# EAGLE schematic PushButton_RGB_w_Test (EAGLE 9.6.2)
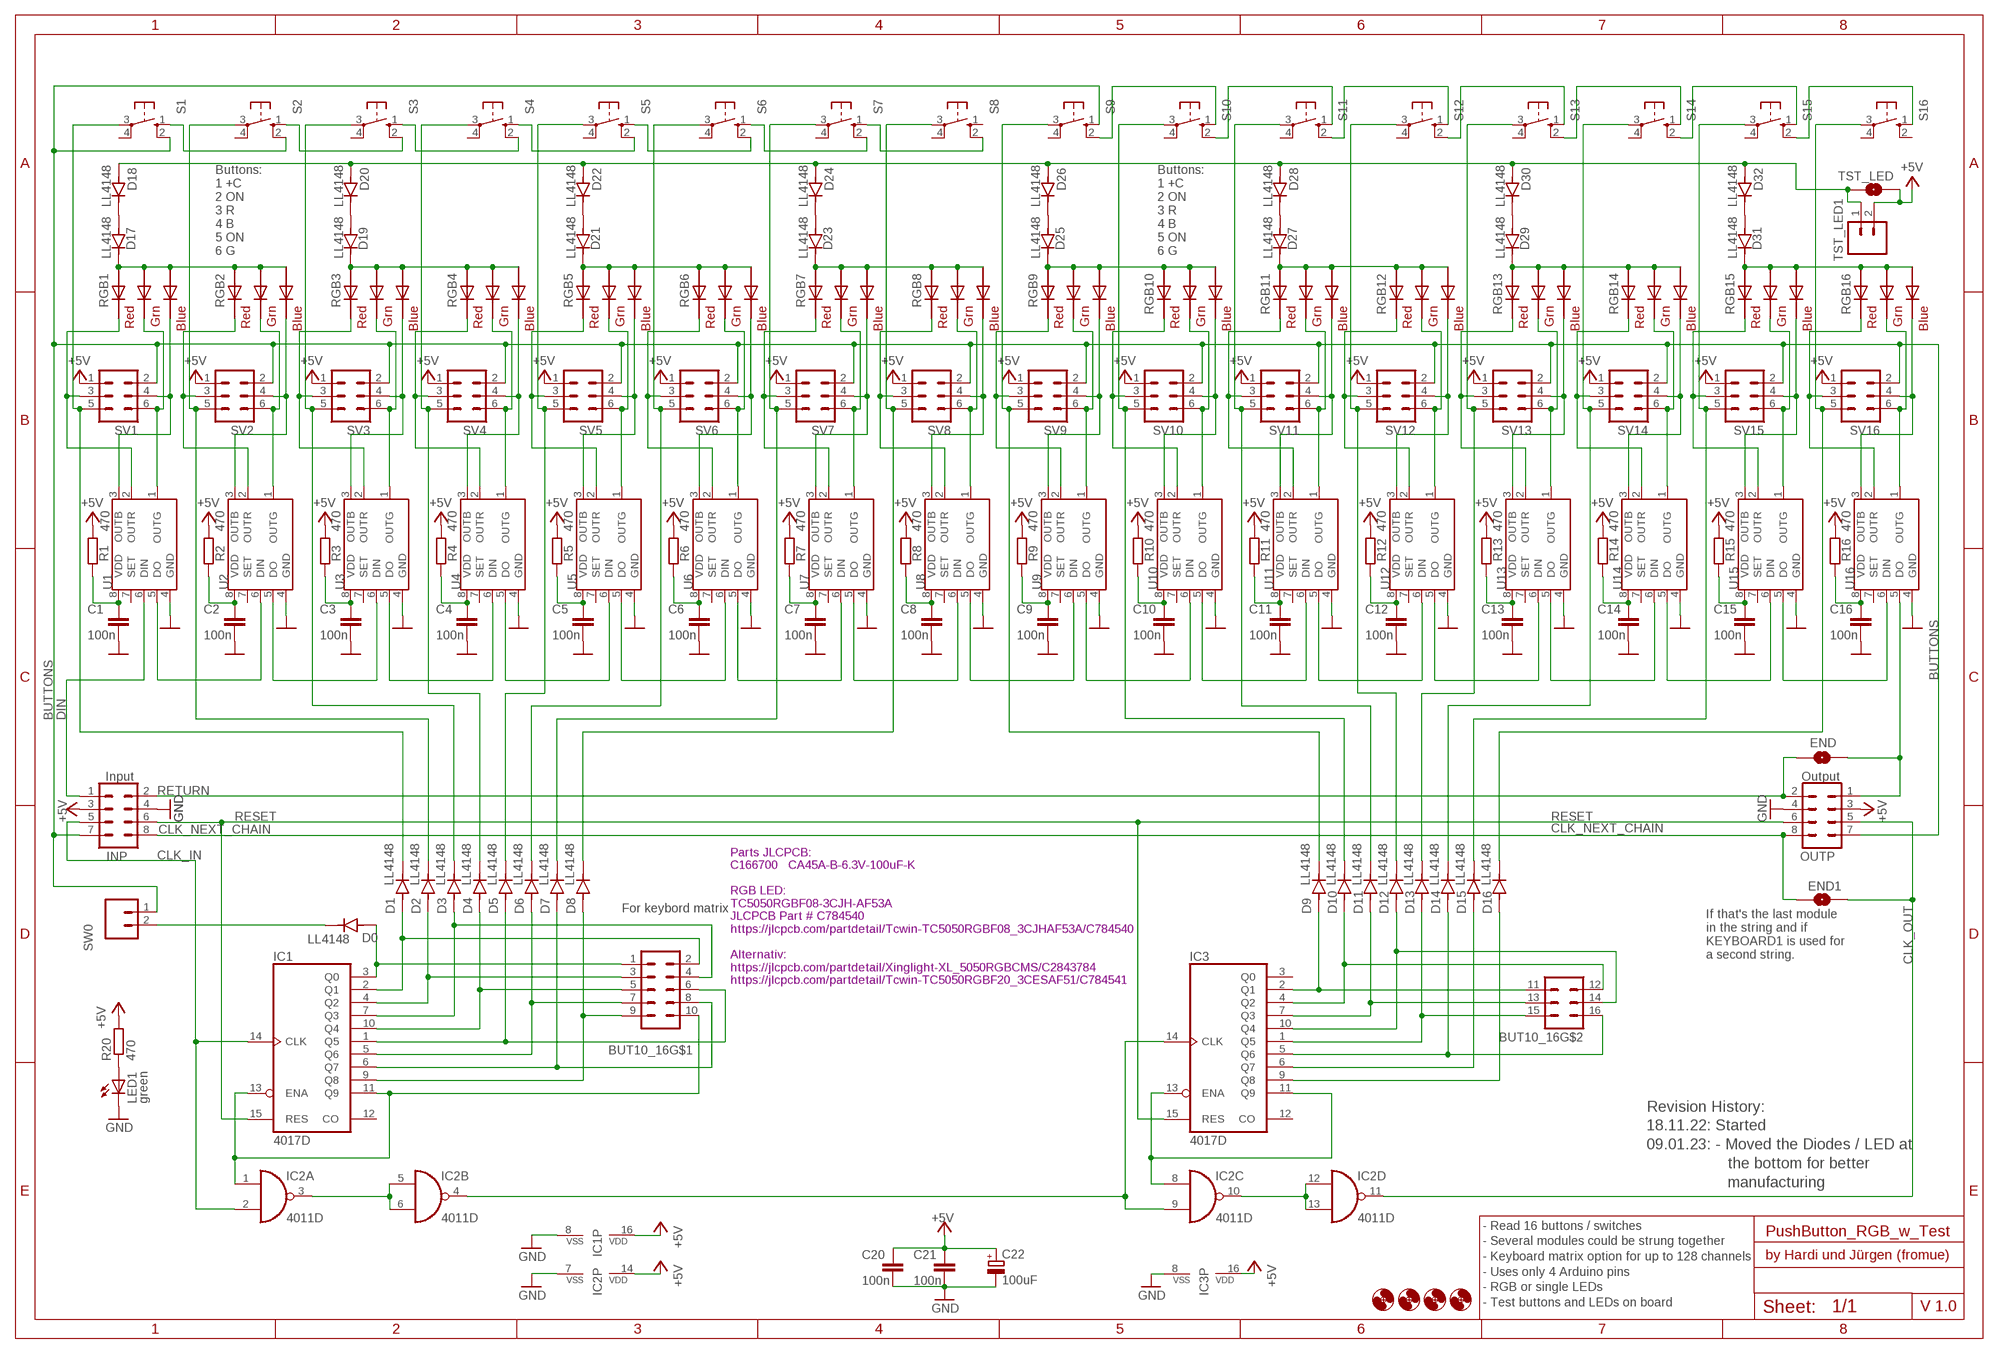
[diagram p0: schematic, sheet 1]

## Parts
BUT10_16  CON-HARTING-ML_ML16-2  [CON-HARTING-ML_ML16]
C1  100n  C-EUC0603  [C0603]
C2  100n  C-EUC0603  [C0603]
C3  100n  C-EUC0603  [C0603]
C4  100n  C-EUC0603  [C0603]
C5  100n  C-EUC0603  [C0603]
C6  100n  C-EUC0603  [C0603]
C7  100n  C-EUC0603  [C0603]
C8  100n  C-EUC0603  [C0603]
C9  100n  C-EUC0603  [C0603]
C10  100n  C-EUC0603  [C0603]
C11  100n  C-EUC0603  [C0603]
C12  100n  C-EUC0603  [C0603]
C13  100n  C-EUC0603  [C0603]
C14  100n  C-EUC0603  [C0603]
C15  100n  C-EUC0603  [C0603]
C16  100n  C-EUC0603  [C0603]
C20  100n  C-EUC0603  [C0603]
C21  100n  C-EUC0603  [C0603]
C22  100uF  CPOL-EUB/3528-21R  [B/3528-21R]
D0  LL4148  [DIO_LL4148]
D1  LL4148  [DIO_LL4148]
D2  LL4148  [DIO_LL4148]
D3  LL4148  [DIO_LL4148]
D4  LL4148  [DIO_LL4148]
D5  LL4148  [DIO_LL4148]
D6  LL4148  [DIO_LL4148]
D7  LL4148  [DIO_LL4148]
D8  LL4148  [DIO_LL4148]
D9  LL4148  [DIO_LL4148]
D10  LL4148  [DIO_LL4148]
D11  LL4148  [DIO_LL4148]
D12  LL4148  [DIO_LL4148]
D13  LL4148  [DIO_LL4148]
D14  LL4148  [DIO_LL4148]
D15  LL4148  [DIO_LL4148]
D16  LL4148  [DIO_LL4148]
D17  LL4148  [DIO_LL4148]
D18  LL4148  [DIO_LL4148]
D19  LL4148  [DIO_LL4148]
D20  LL4148  [DIO_LL4148]
D21  LL4148  [DIO_LL4148]
D22  LL4148  [DIO_LL4148]
D23  LL4148  [DIO_LL4148]
D24  LL4148  [DIO_LL4148]
D25  LL4148  [DIO_LL4148]
D26  LL4148  [DIO_LL4148]
D27  LL4148  [DIO_LL4148]
D28  LL4148  [DIO_LL4148]
D29  LL4148  [DIO_LL4148]
D30  LL4148  [DIO_LL4148]
D31  LL4148  [DIO_LL4148]
D32  LL4148  [DIO_LL4148]
END  SOLDERJUMPERNO  [SJ_2S-NO]
END1  SOLDERJUMPERNO  [SJ_2S-NO]
H1  MOUNT-HOLE3.0  [3,0]
H2  MOUNT-HOLE3.0  [3,0]
H3  MOUNT-HOLE3.0  [3,0]
H4  MOUNT-HOLE3.0  [3,0]
IC1  4017D  [SO16]
IC2  4011D  [SO14]
IC3  4017D  [SO16]
INP  CON-HARTING-ML_ML08  [CON-HARTING-ML_ML08]
LED1  green  LEDCHIPLED_0805  [CHIPLED_0805]
OUTP  CON-HARTING-ML_ML08  [CON-HARTING-ML_ML08]
R1  470  R-EU_R0603  [R0603]
R2  470  R-EU_R0603  [R0603]
R3  470  R-EU_R0603  [R0603]
R4  470  R-EU_R0603  [R0603]
R5  470  R-EU_R0603  [R0603]
R6  470  R-EU_R0603  [R0603]
R7  470  R-EU_R0603  [R0603]
R8  470  R-EU_R0603  [R0603]
R9  470  R-EU_R0603  [R0603]
R10  470  R-EU_R0603  [R0603]
R11  470  R-EU_R0603  [R0603]
R12  470  R-EU_R0603  [R0603]
R13  470  R-EU_R0603  [R0603]
R14  470  R-EU_R0603  [R0603]
R15  470  R-EU_R0603  [R0603]
R16  470  R-EU_R0603  [R0603]
R20  470  R-EU_R0603  [R0603]
RGB1  RGBLED5050  [RGBLED5050]
RGB2  RGBLED5050  [RGBLED5050]
RGB3  RGBLED5050  [RGBLED5050]
RGB4  RGBLED5050  [RGBLED5050]
RGB5  RGBLED5050  [RGBLED5050]
RGB6  RGBLED5050  [RGBLED5050]
RGB7  RGBLED5050  [RGBLED5050]
RGB8  RGBLED5050  [RGBLED5050]
RGB9  RGBLED5050  [RGBLED5050]
RGB10  RGBLED5050  [RGBLED5050]
RGB11  RGBLED5050  [RGBLED5050]
RGB12  RGBLED5050  [RGBLED5050]
RGB13  RGBLED5050  [RGBLED5050]
RGB14  RGBLED5050  [RGBLED5050]
RGB15  RGBLED5050  [RGBLED5050]
RGB16  RGBLED5050  [RGBLED5050]
S1  10-XXB3F-10XX_SMD  [B3F-10XX_SMD]
S2  10-XXB3F-10XX_SMD  [B3F-10XX_SMD]
S3  10-XXB3F-10XX_SMD  [B3F-10XX_SMD]
S4  10-XXB3F-10XX_SMD  [B3F-10XX_SMD]
S5  10-XXB3F-10XX_SMD  [B3F-10XX_SMD]
S6  10-XXB3F-10XX_SMD  [B3F-10XX_SMD]
S7  10-XXB3F-10XX_SMD  [B3F-10XX_SMD]
S8  10-XXB3F-10XX_SMD  [B3F-10XX_SMD]
S9  10-XXB3F-10XX_SMD  [B3F-10XX_SMD]
S10  10-XXB3F-10XX_SMD  [B3F-10XX_SMD]
S11  10-XXB3F-10XX_SMD  [B3F-10XX_SMD]
S12  10-XXB3F-10XX_SMD  [B3F-10XX_SMD]
S13  10-XXB3F-10XX_SMD  [B3F-10XX_SMD]
S14  10-XXB3F-10XX_SMD  [B3F-10XX_SMD]
S15  10-XXB3F-10XX_SMD  [B3F-10XX_SMD]
S16  10-XXB3F-10XX_SMD  [B3F-10XX_SMD]
SV1  CON-HARTING-ML_ML6  [CON-HARTING-ML_ML6]
SV2  CON-HARTING-ML_ML6  [CON-HARTING-ML_ML6]
SV3  CON-HARTING-ML_ML6  [CON-HARTING-ML_ML6]
SV4  CON-HARTING-ML_ML6  [CON-HARTING-ML_ML6]
SV5  CON-HARTING-ML_ML6  [CON-HARTING-ML_ML6]
SV6  CON-HARTING-ML_ML6  [CON-HARTING-ML_ML6]
SV7  CON-HARTING-ML_ML6  [CON-HARTING-ML_ML6]
SV8  CON-HARTING-ML_ML6  [CON-HARTING-ML_ML6]
SV9  CON-HARTING-ML_ML6  [CON-HARTING-ML_ML6]
SV10  CON-HARTING-ML_ML6  [CON-HARTING-ML_ML6]
SV11  CON-HARTING-ML_ML6  [CON-HARTING-ML_ML6]
SV12  CON-HARTING-ML_ML6  [CON-HARTING-ML_ML6]
SV13  CON-HARTING-ML_ML6  [CON-HARTING-ML_ML6]
SV14  CON-HARTING-ML_ML6  [CON-HARTING-ML_ML6]
SV15  CON-HARTING-ML_ML6  [CON-HARTING-ML_ML6]
SV16  CON-HARTING-ML_ML6  [CON-HARTING-ML_ML6]
SW0  M02PTH  [1X02]
TST_LED  SOLDERJUMPERNO  [SJ_2S-NO]
TST_LED1  Tst_LED  M02PTH  [1X02]
U1  S3PO_MODUL_WS2811_SOUND_MP3-TF-16P_WS2811_AND_ATTINY_WS2811-ICSOP8  [SOP8]
U2  S3PO_MODUL_WS2811_SOUND_MP3-TF-16P_WS2811_AND_ATTINY_WS2811-ICSOP8  [SOP8]
U3  S3PO_MODUL_WS2811_SOUND_MP3-TF-16P_WS2811_AND_ATTINY_WS2811-ICSOP8  [SOP8]
U4  S3PO_MODUL_WS2811_SOUND_MP3-TF-16P_WS2811_AND_ATTINY_WS2811-ICSOP8  [SOP8]
U5  S3PO_MODUL_WS2811_SOUND_MP3-TF-16P_WS2811_AND_ATTINY_WS2811-ICSOP8  [SOP8]
U6  S3PO_MODUL_WS2811_SOUND_MP3-TF-16P_WS2811_AND_ATTINY_WS2811-ICSOP8  [SOP8]
U7  S3PO_MODUL_WS2811_SOUND_MP3-TF-16P_WS2811_AND_ATTINY_WS2811-ICSOP8  [SOP8]
U8  S3PO_MODUL_WS2811_SOUND_MP3-TF-16P_WS2811_AND_ATTINY_WS2811-ICSOP8  [SOP8]
U9  S3PO_MODUL_WS2811_SOUND_MP3-TF-16P_WS2811_AND_ATTINY_WS2811-ICSOP8  [SOP8]
U10  S3PO_MODUL_WS2811_SOUND_MP3-TF-16P_WS2811_AND_ATTINY_WS2811-ICSOP8  [SOP8]
U11  S3PO_MODUL_WS2811_SOUND_MP3-TF-16P_WS2811_AND_ATTINY_WS2811-ICSOP8  [SOP8]
U12  S3PO_MODUL_WS2811_SOUND_MP3-TF-16P_WS2811_AND_ATTINY_WS2811-ICSOP8  [SOP8]
U13  S3PO_MODUL_WS2811_SOUND_MP3-TF-16P_WS2811_AND_ATTINY_WS2811-ICSOP8  [SOP8]
U14  S3PO_MODUL_WS2811_SOUND_MP3-TF-16P_WS2811_AND_ATTINY_WS2811-ICSOP8  [SOP8]
U15  S3PO_MODUL_WS2811_SOUND_MP3-TF-16P_WS2811_AND_ATTINY_WS2811-ICSOP8  [SOP8]
U16  S3PO_MODUL_WS2811_SOUND_MP3-TF-16P_WS2811_AND_ATTINY_WS2811-ICSOP8  [SOP8]

## Nets
+5V: C20.1 C21.1 C22.+ IC1.16(VDD) IC2.14(P:VDD) IC3.16(VDD) INP.3 OUTP.3 R1.2 R2.2 R3.2 R4.2 R5.2 R6.2 R7.2 R8.2 R9.2 R10.2 R11.2 R12.2 R13.2 R14.2 R15.2 R16.2 R20.2 SV1.1 SV2.1 SV3.1 SV4.1 SV5.1 SV6.1 SV7.1 SV8.1 SV9.1 SV10.1 SV11.1 SV12.1 SV13.1 SV14.1 SV15.1 SV16.1 TST_LED1.2 TST_LED.1
BUTTONS: INP.7 OUTP.7 S1.2(S1) S9.1(S) SV1.2 SV2.2 SV3.2 SV4.2 SV5.2 SV6.2 SV7.2 SV8.2 SV9.2 SV10.2 SV11.2 SV12.2 SV13.2 SV14.2 SV15.2 SV16.2 SW0.1
CLK_IN: IC1.14(CLK) IC2.2(A:I1) INP.5
CLK_NEXT_CHAIN: END1.2 INP.8 OUTP.8
CLK_OUT: END1.1 IC2.11(D:O) OUTP.5
DIN: INP.1 U1.6(DIN)
GND: C1.2 C2.2 C3.2 C4.2 C5.2 C6.2 C7.2 C8.2 C9.2 C10.2 C11.2 C12.2 C13.2 C14.2 C15.2 C16.2 C20.2 C21.2 C22.- IC1.8(VSS) IC2.7(P:VSS) IC3.8(VSS) INP.4 LED1.C OUTP.4 U1.4(GND) U2.4(GND) U3.4(GND) U4.4(GND) U5.4(GND) U6.4(GND) U7.4(GND) U8.4(GND) U9.4(GND) U10.4(GND) U11.4(GND) U12.4(GND) U13.4(GND) U14.4(GND) U15.4(GND) U16.4(GND)
N$1: IC2.3(A:O) IC2.5(B:I0) IC2.6(B:I1)
N$2: U10.5(DO) U11.6(DIN)
N$3: BUT10_16.11 D9.A IC3.2(Q1)
N$4: U1.5(DO) U2.6(DIN)
N$5: BUT10_16.10 IC1.11(Q9) IC1.13(ENA) IC2.1(A:I0)
N$6: C2.1 R2.1 U2.8(VDD)
N$7: D0.C SW0.2
N$8: RGB2.4(BLUE_C) SV2.4 U2.3(OUTB)
N$9: RGB2.6(GREEN_C) SV2.6 U2.1(OUTG)
N$10: RGB2.5(RED_C) SV2.3 U2.2(OUTR)
N$11: BUT10_16.2 D1.A IC1.2(Q1)
N$12: BUT10_16.3 D2.A IC1.4(Q2)
N$13: BUT10_16.4 D3.A IC1.7(Q3)
N$14: BUT10_16.5 D4.A IC1.10(Q4)
N$15: BUT10_16.6 D5.A IC1.1(Q5)
N$16: BUT10_16.7 D6.A IC1.5(Q6)
N$17: BUT10_16.8 D7.A IC1.6(Q7)
N$18: BUT10_16.9 D8.A IC1.9(Q8)
N$19: RGB1.5(RED_C) SV1.3 U1.2(OUTR)
N$20: D18.A D20.A D22.A D24.A D26.A D28.A D30.A D32.A TST_LED1.1 TST_LED.2
N$21: LED1.A R20.1
N$22: D17.A D18.C
N$23: S1.1(S) S2.2(S1)
N$24: U2.5(DO) U3.6(DIN)
N$25: D10.C S10.3(P) SV10.5
N$26: RGB1.4(BLUE_C) SV1.4 U1.3(OUTB)
N$27: RGB1.6(GREEN_C) SV1.6 U1.1(OUTG)
N$28: BUT10_16.12 D10.A IC3.4(Q2)
N$29: BUT10_16.13 D11.A IC3.7(Q3)
N$30: BUT10_16.14 D12.A IC3.10(Q4)
N$31: BUT10_16.15 D13.A IC3.1(Q5)
N$32: S2.1(S) S3.2(S1)
N$33: BUT10_16.16 D14.A IC3.5(Q6)
N$34: S3.1(S) S4.2(S1)
N$35: BUT10_16.1 D0.A IC1.3(Q0)
N$36: D15.A IC3.6(Q7)
N$37: D16.A IC3.9(Q8)
N$38: IC2.10(C:O) IC2.12(D:I0) IC2.13(D:I1)
N$39: D19.A D20.C
N$40: IC2.8(C:I0) IC3.11(Q9) IC3.13(ENA)
N$41: IC2.4(B:O) IC2.9(C:I1) IC3.14(CLK)
N$42: S4.1(S) S5.2(S1)
N$43: D21.A D22.C
N$44: S5.1(S) S6.2(S1)
N$45: C3.1 R3.1 U3.8(VDD)
N$46: D3.C S3.3(P) SV3.5
N$47: RGB3.4(BLUE_C) SV3.4 U3.3(OUTB)
N$48: RGB3.6(GREEN_C) SV3.6 U3.1(OUTG)
N$49: RGB3.5(RED_C) SV3.3 U3.2(OUTR)
N$50: D19.C RGB3.1(GREEN_A) RGB3.2(RED_A) RGB3.3(BLUE_A) RGB4.1(GREEN_A) RGB4.2(RED_A) RGB4.3(BLUE_A)
N$51: S6.1(S) S7.2(S1)
N$52: U3.5(DO) U4.6(DIN)
N$53: D23.A D24.C
N$54: S7.1(S) S8.2(S1)
N$55: D25.A D26.C
N$56: C4.1 R4.1 U4.8(VDD)
N$57: S9.2(S1) S10.1(S)
N$58: RGB4.4(BLUE_C) SV4.4 U4.3(OUTB)
N$59: RGB4.6(GREEN_C) SV4.6 U4.1(OUTG)
N$60: RGB4.5(RED_C) SV4.3 U4.2(OUTR)
N$61: S10.2(S1) S11.1(S)
N$62: S11.2(S1) S12.1(S)
N$63: U4.5(DO) U5.6(DIN)
N$64: D27.A D28.C
N$65: S12.2(S1) S13.1(S)
N$66: D29.A D30.C
N$67: C5.1 R5.1 U5.8(VDD)
N$68: S13.2(S1) S14.1(S)
N$69: RGB5.4(BLUE_C) SV5.4 U5.3(OUTB)
N$70: RGB5.6(GREEN_C) SV5.6 U5.1(OUTG)
N$71: RGB5.5(RED_C) SV5.3 U5.2(OUTR)
N$72: D21.C RGB5.1(GREEN_A) RGB5.2(RED_A) RGB5.3(BLUE_A) RGB6.1(GREEN_A) RGB6.2(RED_A) RGB6.3(BLUE_A)
N$73: S14.2(S1) S15.1(S)
N$74: D31.A D32.C
N$75: U5.5(DO) U6.6(DIN)
N$76: C1.1 R1.1 U1.8(VDD)
N$77: S15.2(S1) S16.1(S)
N$80: C6.1 R6.1 U6.8(VDD)
N$82: RGB6.4(BLUE_C) SV6.4 U6.3(OUTB)
N$83: RGB6.6(GREEN_C) SV6.6 U6.1(OUTG)
N$84: RGB6.5(RED_C) SV6.3 U6.2(OUTR)
N$87: U6.5(DO) U7.6(DIN)
N$91: C7.1 R7.1 U7.8(VDD)
N$93: C10.1 R10.1 U10.8(VDD)
N$96: RGB7.4(BLUE_C) SV7.4 U7.3(OUTB)
N$97: RGB7.6(GREEN_C) SV7.6 U7.1(OUTG)
N$98: RGB7.5(RED_C) SV7.3 U7.2(OUTR)
N$99: D23.C RGB7.1(GREEN_A) RGB7.2(RED_A) RGB7.3(BLUE_A) RGB8.1(GREEN_A) RGB8.2(RED_A) RGB8.3(BLUE_A)
N$101: U7.5(DO) U8.6(DIN)
N$105: C8.1 R8.1 U8.8(VDD)
N$107: RGB8.4(BLUE_C) SV8.4 U8.3(OUTB)
N$108: RGB8.6(GREEN_C) SV8.6 U8.1(OUTG)
N$109: RGB8.5(RED_C) SV8.3 U8.2(OUTR)
N$112: U8.5(DO) U9.6(DIN)
N$116: RGB10.4(BLUE_C) SV10.4 U10.3(OUTB)
N$117: RGB10.6(GREEN_C) SV10.6 U10.1(OUTG)
N$118: RGB10.5(RED_C) SV10.3 U10.2(OUTR)
N$119: C12.1 R12.1 U12.8(VDD)
N$120: D1.C S1.3(P) SV1.5
N$121: D2.C S2.3(P) SV2.5
N$123: D4.C S4.3(P) SV4.5
N$124: D5.C S5.3(P) SV5.5
N$125: D6.C S6.3(P) SV6.5
N$126: D7.C S7.3(P) SV7.5
N$127: D8.C S8.3(P) SV8.5
N$128: C9.1 R9.1 U9.8(VDD)
N$129: D17.C RGB1.1(GREEN_A) RGB1.2(RED_A) RGB1.3(BLUE_A) RGB2.1(GREEN_A) RGB2.2(RED_A) RGB2.3(BLUE_A)
N$130: D12.C S12.3(P) SV12.5
N$132: D9.C S9.3(P) SV9.5
N$134: RGB12.4(BLUE_C) SV12.4 U12.3(OUTB)
N$136: RGB9.4(BLUE_C) SV9.4 U9.3(OUTB)
N$137: RGB9.6(GREEN_C) SV9.6 U9.1(OUTG)
N$138: RGB9.5(RED_C) SV9.3 U9.2(OUTR)
N$139: D25.C RGB9.1(GREEN_A) RGB9.2(RED_A) RGB9.3(BLUE_A) RGB10.1(GREEN_A) RGB10.2(RED_A) RGB10.3(BLUE_A)
N$141: U9.5(DO) U10.6(DIN)
N$145: C11.1 R11.1 U11.8(VDD)
N$146: D11.C S11.3(P) SV11.5
N$147: RGB11.4(BLUE_C) SV11.4 U11.3(OUTB)
N$148: RGB11.6(GREEN_C) SV11.6 U11.1(OUTG)
N$149: RGB11.5(RED_C) SV11.3 U11.2(OUTR)
N$152: U11.5(DO) U12.6(DIN)
N$155: RGB12.6(GREEN_C) SV12.6 U12.1(OUTG)
N$156: RGB12.5(RED_C) SV12.3 U12.2(OUTR)
N$157: D27.C RGB11.1(GREEN_A) RGB11.2(RED_A) RGB11.3(BLUE_A) RGB12.1(GREEN_A) RGB12.2(RED_A) RGB12.3(BLUE_A)
N$159: U12.5(DO) U13.6(DIN)
N$163: C13.1 R13.1 U13.8(VDD)
N$164: D13.C S13.3(P) SV13.5
N$165: RGB13.4(BLUE_C) SV13.4 U13.3(OUTB)
N$166: RGB13.6(GREEN_C) SV13.6 U13.1(OUTG)
N$167: RGB13.5(RED_C) SV13.3 U13.2(OUTR)
N$168: D29.C RGB13.1(GREEN_A) RGB13.2(RED_A) RGB13.3(BLUE_A) RGB14.1(GREEN_A) RGB14.2(RED_A) RGB14.3(BLUE_A)
N$170: U13.5(DO) U14.6(DIN)
N$174: C14.1 R14.1 U14.8(VDD)
N$175: D14.C S14.3(P) SV14.5
N$176: RGB14.4(BLUE_C) SV14.4 U14.3(OUTB)
N$177: RGB14.6(GREEN_C) SV14.6 U14.1(OUTG)
N$178: RGB14.5(RED_C) SV14.3 U14.2(OUTR)
N$181: U14.5(DO) U15.6(DIN)
N$185: C15.1 R15.1 U15.8(VDD)
N$186: D15.C S15.3(P) SV15.5
N$187: RGB15.4(BLUE_C) SV15.4 U15.3(OUTB)
N$188: RGB15.6(GREEN_C) SV15.6 U15.1(OUTG)
N$189: RGB15.5(RED_C) SV15.3 U15.2(OUTR)
N$190: D31.C RGB15.1(GREEN_A) RGB15.2(RED_A) RGB15.3(BLUE_A) RGB16.1(GREEN_A) RGB16.2(RED_A) RGB16.3(BLUE_A)
N$192: U15.5(DO) U16.6(DIN)
N$196: C16.1 R16.1 U16.8(VDD)
N$197: D16.C S16.3(P) SV16.5
N$198: RGB16.4(BLUE_C) SV16.4 U16.3(OUTB)
N$199: RGB16.6(GREEN_C) SV16.6 U16.1(OUTG)
N$200: RGB16.5(RED_C) SV16.3 U16.2(OUTR)
N$203: END.2 OUTP.1 U16.5(DO)
RESET: IC1.15(RES) IC3.15(RES) INP.6 OUTP.6
RETURN: END.1 INP.2 OUTP.2
Unconnected: IC1.12(CO) IC3.3(Q0) IC3.12(CO) S1.4(P1) S2.4(P1) S3.4(P1) S4.4(P1) S5.4(P1) S6.4(P1) S7.4(P1) S8.1(S) S8.4(P1) S9.4(P1) S10.4(P1) S11.4(P1) S12.4(P1) S13.4(P1) S14.4(P1) S15.4(P1) S16.2(S1) S16.4(P1) U1.7(SET) U2.7(SET) U3.7(SET) U4.7(SET) U5.7(SET) U6.7(SET) U7.7(SET) U8.7(SET) U9.7(SET) U10.7(SET) U11.7(SET) U12.7(SET) U13.7(SET) U14.7(SET) U15.7(SET) U16.7(SET)

## Notes on the sheet
- Buttons:
  1 +C
  2 ON
  3 R
  4 B
  5 ON
  6 G
- Buttons:
  1 +C
  2 ON
  3 R
  4 B
  5 ON
  6 G
- Input | Output
- Parts JLCPCB:
  C166700   CA45A-B-6.3V-100uF-K
  
  RGB LED:
  TC5050RGBF08-3CJH-AF53A
  JLCPCB Part # C784540
  https://jlcpcb.com/partdetail/Tcwin-TC5050RGBF08_3CJHAF53A/C784540
  
  Alternativ:
  https://jlcpcb.com/partdetail/Xinglight-XL_5050RGBCMS/C2843784
  https://jlcpcb.com/partdetail/Tcwin-TC5050RGBF20_3CESAF51/C784541
- For keybord matrix
- If that's the last module
  in the string and if
  KEYBOARD1 is used for
  a second string.
- Revision History:
  18.11.22: Started
  09.01.23: - Moved the Diodes / LED at
                    the bottom for better
                    manufacturing
- - Read 16 buttons / switches
  - Several modules could be strung together
  - Keyboard matrix option for up to 128 channels
  - Uses only 4 Arduino pins
  - RGB or single LEDs
  - Test buttons and LEDs on board
- by Hardi und Jürgen (fromue)
- V 1.0

## Library data of the parts
BUT10_16 = PushButtonAction_4017_2:CON-HARTING-ML_ML16-2: HARTING
C1-C16 C20 C21 = rcl:C-EU: CAPACITOR, European symbol; SPICEPREFIX: C
C22 = rcl:CPOL-EU: POLARIZED CAPACITOR, European symbol; SPICEPREFIX: C
D0 D1-D32 = LL4148:LL4148: Surface Mount Switching Glass Check availability <https://pricing.snapeda.com/parts/LL4148/ON/view-part?ref=eda>; AVAILABILITY: In Stock; DESCRIPTION: Diode Standard 75V 300mA (DC) Surface Mount Mini MELF/DL-35; MF: ON; MP: LL4148; PACKAGE: SOD-80 Fairchild Semiconductor; PRICE: None
END END1 TST_LED = SparkFun-Retired:SOLDERJUMPER: Solder Jumper Standard SMD solder jumper. Used to automate production. Two varients : Normally Open and Normally Closed are the same, but have different paste layers. NC will have a large amount of paste and should jumper during reflow.
H1-H4 = holes:MOUNT-HOLE: MOUNTING HOLE with drill center marker
IC1 IC3 = 40xx:4017: COUNTER/DIVIDER
IC2 = 40xx:4011: Quad 2-input NAND; SPICEPREFIX: J
INP OUTP = PushButtonAction_4017_2:CON-HARTING-ML_ML08: Modified by Hardi; OC_FARNELL: unknown; OC_NEWARK: unknown
LED1 = led:LED: LED OSRAM: - CHIPLED LG R971, LG N971, LY N971, LG Q971, LY Q971, LO R971, LY R971 LH N974, LH R974 LS Q976, LO Q976, LY Q976 LO Q996 - Hyper CHIPLED LW Q18S LB Q993, LB Q99A, LB R99A - SideLED LS A670, LO A670, LY A670, LG A670, LP A670 LB A673, LV A673, LT A673, LW A673 LH A674 LY A675 LS A676, LA A676, LO A676, LY A676, LW A676 LS A679, LY A679, LG A679 - Hyper Micro SIDELED® LS Y876, LA Y876, LO Y876, LY Y876 LT Y87S - SmartLED LW L88C, LW L88S LB L89C, LB L89S, LG L890 LS L89K, LO L89K, LY L89K LS L896, LA L896, LO L896, LY L896 - TOPLED LS T670, LO T670, LY T670, LG T670, LP T670 LSG T670, LSP T670, LSY T670, LOP T670, LYG T670 LG T671, LOG T671, LSG T671 LB T673, LV T673, LT T673, LW T673 LH T674 LS T676, LA T676, LO T676, LY T676, LB T676, LH T676, LSB T676, LW T676 LB T67C, LV T67C, LT T67C, LS T67K, LO T67K, LY T67K, LW E67C LS E67B, LA E67B, LO E67B, LY E67B, LB E67C, LV E67C, LT E67C LW T67C LS T679, LY T679, LG T679 LS T770, LO T770, LY T770, LG T770, LP T770 LB T773, LV T773, LT T773, LW T773 LH T774 LS E675, LA E675, LY E675, LS T675 LS T776, LA T776, LO T776, LY T776, LB T776 LHGB T686 LT T68C, LB T68C - Hyper Mini TOPLED® LB M676 - Mini TOPLED Santana® LG M470 LS M47K, LO M47K, LY M47K Source: http://www.osram.convergy.de LUXEON: - LUMILED® LXK2-PW12-R00, LXK2-PW12-S00, LXK2-PW14-U00, LXK2-PW14-V00 LXK2-PM12-R00, LXK2-PM12-S00, LXK2-PM14-U00 LXK2-PE12-Q00, LXK2-PE12-R00, LXK2-PE12-S00, LXK2-PE14-T00, LXK2-PE14-U00 LXK2-PB12-K00, LXK2-PB12-L00, LXK2-PB12-M00, LXK2-PB14-N00, LXK2-PB14-P00, LXK2-PB14-Q00 LXK2-PR12-L00, LXK2-PR12-M00, LXK2-PR14-Q00, LXK2-PR14-R00 LXK2-PD12-Q00, LXK2-PD12-R00, LXK2-PD12-S00 LXK2-PH12-R00, LXK2-PH12-S00 LXK2-PL12-P00, LXK2-PL12-Q00, LXK2-PL12-R00 Source: www.luxeon.com KINGBRIGHT: KA-3528ASYC Source: www.kingbright.com
R1-R16 R20 = rcl:R-EU_: RESISTOR, European symbol; SPICEPREFIX: R
RGB1-RGB16 = adafruit:RGBLED: For 5050 RGB LEDs, the order of the LEDs may vary from one manufacturer to another!
S1-S16 = switch-omron:10-XX: OMRON SWITCH
SV1-SV16 = PushButtonAction_4017_4:CON-HARTING-ML_ML6: HARTING; OC_FARNELL: unknown; OC_NEWARK: unknown
SW0 TST_LED1 = SparkFun-Connectors:M02: Standard 2-pin 0.1" header. Use with - straight break away headers ( PRT-00116) - right angle break away headers (PRT-00553) - swiss pins (PRT-00743) - machine pins (PRT-00117) - female headers (PRT-00115) Molex polarized connector foot print use with: PRT-08233 with associated crimp pins and housings. 2.54_SCREWTERM for use with PRT-10571. 3.5mm Screw Terminal footprints for PRT-08084 5mm Screw Terminal footprints for use with PRT-08432
U1-U16 = S3PO_Modul_WS2811:S3PO_MODUL_WS2811_SOUND_MP3-TF-16P_WS2811_AND_ATTINY_WS2811-IC: Die Pin Nummern für R und G sind getauscht damit sie gleich angesteuert werden wie die WS2812. Der Daten Strom der WS2811 ist RGB, Beim WS2812 ist es aber GRB.